# Altium schematic sheet 显示板.SchDoc
size A4
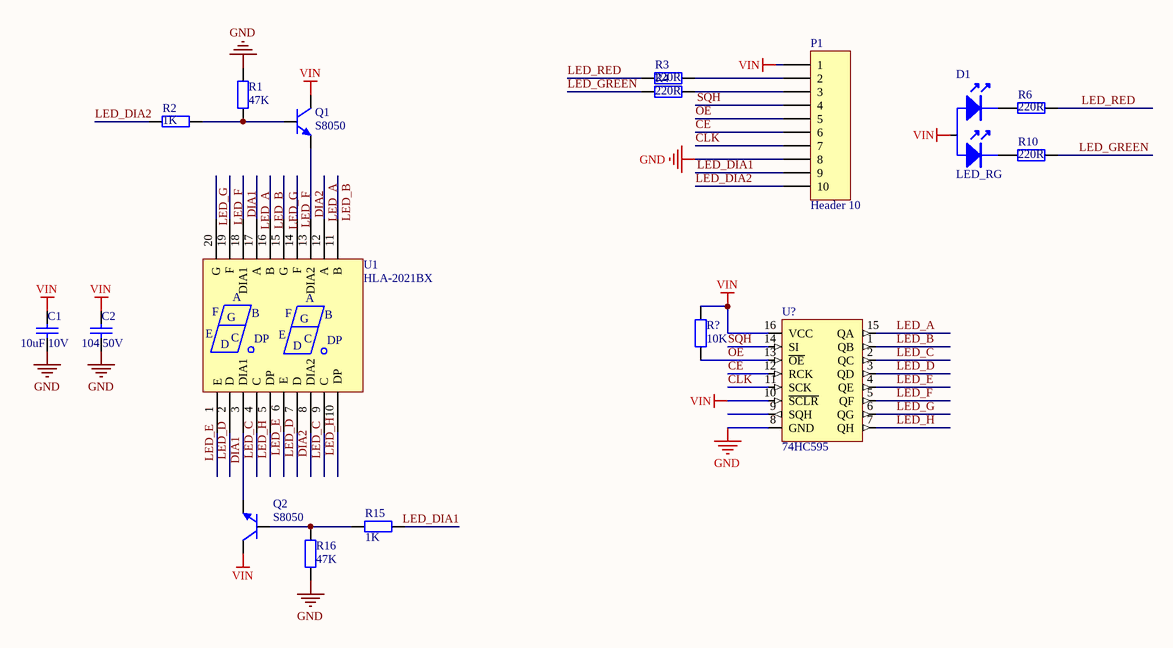
[diagram p0: 显示板.SchDoc]

## Parts
C1  10uF 10V  [SMD-0603C]
C2  104 50V  [SMD-0603C]
D1  LED_RG  [LED_RG]
P1  Header 10
Q1  S8050  [SOT-23]
Q2  S8050  [SOT-23]
R1  47K  [SMD-0603]
R2  1K  [SMD-0603]
R3  220R  [SMD-0603]
R4  220R  [SMD-0603]
R6  220R  [SMD-0603]
R10  220R  [SMD-0603]
R15  1K  [SMD-0603]
R16  47K  [SMD-0603]
R?  10K  [SMD-0603]
U1  HLA-2021BX  [HLA-2021BX]
U?  74HC595  [SSOP-16]

## Nets
GND: C1.1 C2.1 P1.8 R1.2 R16.2 U?.8(GND)
VIN: C1.2 C2.2 D1.2 P1.1 Q1.3(C) Q2.3(C) R?.2 U?.10(~{SCLR}) U?.16(VCC)
CE: P1.6 U?.12(RCK)
CLK: P1.7 U?.11(SCK)
DIA1: Q2.2(E) U1.3(DIA1) U1.18(DIA1)
DIA2: Q1.2(E) U1.8(DIA2) U1.13(DIA2)
LED_A: U1.12(A) U1.17(A) U?.15(QA)
LED_B: U1.11(B) U1.16(B) U?.1(QB)
LED_C: U1.4(C) U1.9(C) U?.2(QC)
LED_D: U1.2(D) U1.7(D) U?.3(QD)
LED_DIA1: P1.9
LED_DIA2: P1.10 R2.1
LED_E: U1.1(E) U1.6(E) U?.4(QE)
LED_F: U1.14(F) U1.19(F) U?.5(QF)
LED_G: U?.6(QG)
LED_GREEN: R4.1 R10.2
LED_H: U1.5(DP) U1.10(DP) U?.7(QH)
LED_RED: R3.1 R6.2
OE: P1.5 R?.1 U?.13(~{OE})
SQH: P1.4 U?.14(SI)
NetD1_1: D1.1 R6.1
NetD1_3: D1.3 R10.1
NetP1_2: P1.2 R3.2
NetP1_3: P1.3 R4.2
NetQ1_1: Q1.1(B) R1.1 R2.2
NetQ2_1: Q2.1(B) R15.2 R16.1

Not connected (* = marked no-connect by the designer): R15 1; U1 15(G) 20(G); U? 9(SQH)

## Notes on the sheet
- Labels drawn without touching a wire or pin: LED_DIA1, LED_G

## Library data of the parts
C1 C2 = CAP4: 贴片电容 10%
P1 = Header 10: Header, 10-Pin; LatestRevisionDate: 17-Jul-2002; LatestRevisionNote: Re-released for DXP Platform.; Publisher: Altium Limited
Q1 Q2 = NPN-1: NPN
R1-R4 R6 R10 R15 R16 R? = RES0: 贴片电阻 5%
U? = 74HC595: 逻辑IC